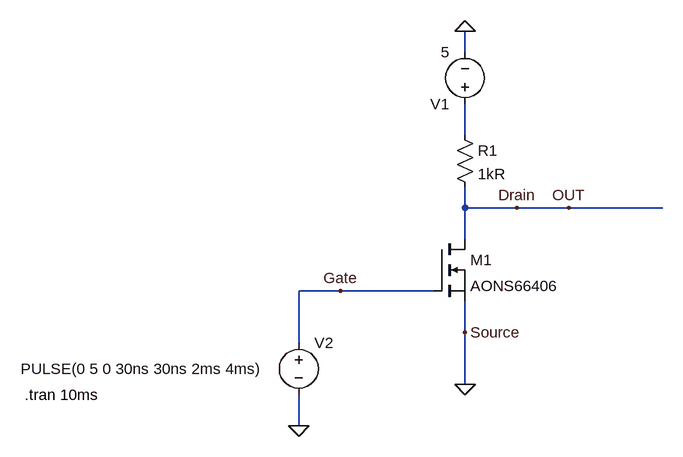
[diagram p0: schematic TP1_NOT.asc]
TP1_NOT.asc, the LTspice schematic file:
Version 4
SHEET 1 880 728
WIRE 32 112 32 80
WIRE 32 240 32 192
WIRE 32 352 32 320
WIRE 112 352 32 352
WIRE 192 352 112 352
WIRE 336 352 192 352
WIRE 32 400 32 352
WIRE -160 480 -224 480
WIRE -16 480 -160 480
WIRE 32 544 32 496
WIRE -224 560 -224 480
WIRE 32 624 32 544
WIRE -224 688 -224 640
FLAG -224 688 0
FLAG 32 624 0
FLAG 32 80 0
FLAG 192 352 OUT
FLAG -160 480 Gate
FLAG 112 352 Drain
FLAG 32 544 Source
SYMBOL voltage 32 208 R180
WINDOW 123 0 0 Left 0
WINDOW 39 0 0 Left 0
SYMATTR InstName V1
SYMATTR Value 5
SYMBOL voltage -224 544 R0
WINDOW 3 -428 56 Left 2
WINDOW 123 0 0 Left 0
WINDOW 39 0 0 Left 0
SYMATTR InstName V2
SYMATTR Value PULSE(0 5 0 30ns 30ns 2ms 4ms)
SYMBOL res 16 224 R0
SYMATTR InstName R1
SYMATTR Value 1kR
SYMBOL nmos -16 400 R0
SYMATTR InstName M1
SYMATTR Value AONS66406
TEXT -646 640 Left 2 !.tran 10ms

The netlist it stands for:
* TP1_NOT.asc
V1 N001 0 5
V2 Gate 0 PULSE(0 5 0 30ns 30ns 2ms 4ms)
R1 N001 Drain 1kR
M1 Drain Gate 0 0 AONS66406
.model NMOS NMOS
.model PMOS PMOS
.lib standard.mos
.tran 10ms
.backanno
.end